# Altium schematic sheet Reid Orthotic v2 PWR.SchDoc: CAL1020 PWR
size A4; DrawnBy: Alex Gilmour; DocumentNumber: 5; Revision: v2; SheetNumber: 5; SheetTotal: 5; PageSetup: Record=PageOptions|CenterHorizontal=True|CenterVertical=True|PrintScale=0.73|XCorrection=1.00|YCorrection=1.00|PrintKind=0|BorderSize=5000000|LeftOffset=0|BottomOffset=0|Orientation=2|PaperLength=1000|PaperWidth=1000|Scale=100|PaperSource=7|PrintQuality=-3|MediaType=1|DitherType=10|PrintScaleMode=1|PaperKind=A4|PaperIndex=9
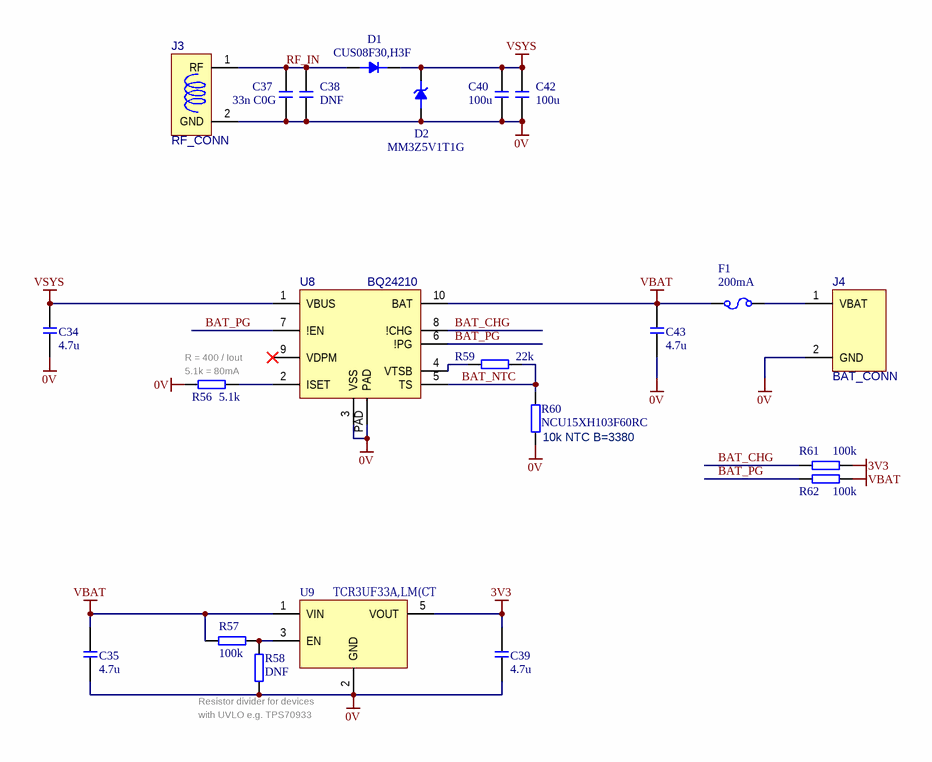
[diagram p0: Reid Orthotic v2 PWR.SchDoc]

## Parts
C34  4.7u  [0603 CAP HD]
C35  4.7u  [0603 CAP HD]
C37  33n C0G  [0805 CAP]
C38  DNF  [0805 CAP]
C39  4.7u  [0603 CAP HD]
C40  100u  [0805 CAP]
C42  100u  [0805 CAP]
C43  4.7u  [0603 CAP HD]
D1  CUS08F30,H3F  [SOD-323]
D2  MM3Z5V1T1G  [SOD-323]
F1  200mA  [0603 FUSE]
J3  RF_CONN  [RF_CONN]
J4  BAT_CONN  [BAT_CONN]
R56  5.1k  [0402 RES HD]
R57  100k  [0402 RES HD]
R58  DNF  [0402 RES HD]
R59  22k  [0402 RES HD]
R60  NCU15XH103F60RC  [0402 RES HD]
R61  100k  [0402 RES HD]
R62  100k  [0402 RES HD]
U8  BQ24210  [BQ24210]
U9  ‎TCR3UF33A,LM(CT  [SOT23-5]

## Nets
0V: C34.1 C35.1 C37.1 C38.1 C39.1 C40.1 C42.1 C43.1 D2.A J3.2(GND) J4.2(GND) R56.2 R58.2 R60.1 U8.3(VSS) U8.PAD U9.2(GND)
3V3: C39.2 R61.1 U9.5(VOUT)
VBAT: C35.2 C43.2 F1.2 R57.2 R62.1 U8.10(BAT) U9.1(VIN)
VSYS: C34.2 C40.2 C42.2 D1.K D2.K U8.1(VBUS)
BAT_CHG: R61.2 U8.8(!CHG)
BAT_NTC: R59.2 R60.2 U8.5(TS)
BAT_PG: R62.2 U8.6(!PG) U8.7(!EN)
RF_IN: C37.2 C38.2 D1.A J3.1(RF)
NetF1_1: F1.1 J4.1(VBAT)
NetR56_1: R56.1 U8.2(ISET)
NetR57_1: R57.1 R58.1 U9.3(EN)
NetR59_1: R59.1 U8.4(VTSB)

Not connected (* = marked no-connect by the designer): U8 9(VDPM)*

## Notes on the sheet
- (near R56) 5.1k = 80mA
- (near R56) R = 400 / Iout
- (near R60) 10k NTC B=3380
- (near R58) Resistor divider for devices
- with UVLO e.g. TPS70933
- A.B.N. 89 367 394 425
- Revision
- Drawn by
- Last updated
- Sheet
- of

## Library data of the parts
C34 C35 C37-C40 C42 C43 = Capacitor
D1 = Diode
D2 = Diode Zener
F1 = Fuse
R56-R62 = Resistor
U9 = MIC5504-x.xYM5